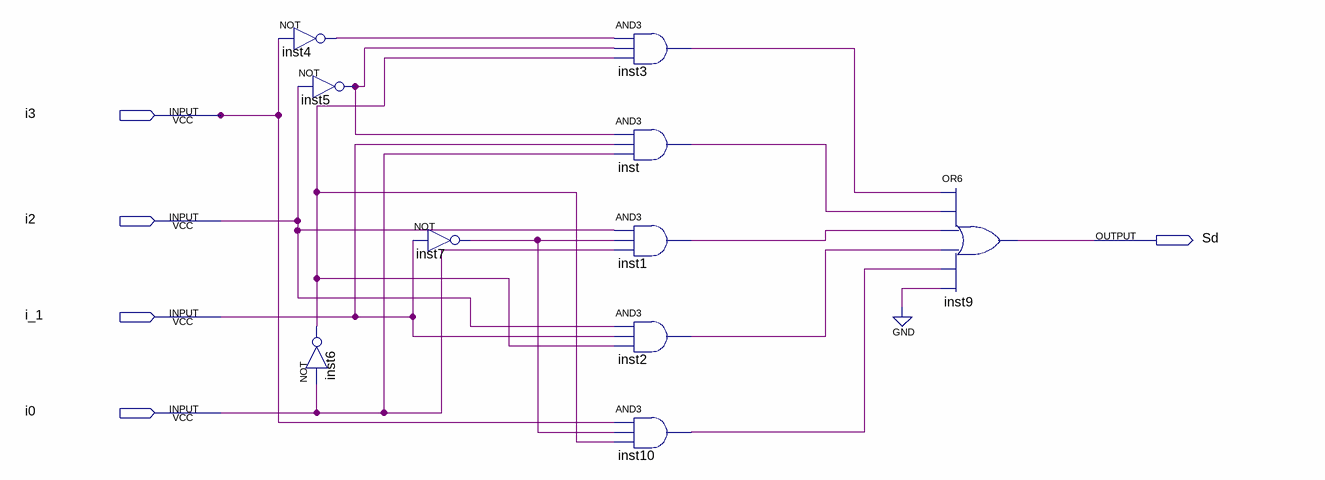
[diagram p0: schematic sheet]
// Quartus schematic lab05_d_top.bdf as structural Verilog: 10 symbols, 5 pins
module lab05_d_top (
  input  i3,
  input  i2,
  input  i_1,
  input  i0,
  output Sd
);

  wire inst1_out, inst2_out, inst3_out, inst4_out, inst5_out, inst6_out, inst7_out, inst10_out, inst_out;

  not inst4 (inst4_out, i3);
  not inst5 (inst5_out, i2);
  not inst6 (inst6_out, i0);
  not inst7 (inst7_out, i_1);
  and inst3 (inst3_out, inst4_out, inst5_out, inst6_out);
  and inst (inst_out, inst5_out, i_1, i0);
  and inst1 (inst1_out, i2, inst7_out, i0);
  and inst2 (inst2_out, i2, i_1, inst6_out);
  and inst10 (inst10_out, i3, inst7_out, inst6_out);
  or inst9 (Sd, inst3_out, inst_out, inst1_out, inst2_out, inst10_out, 1'b0);
endmodule
